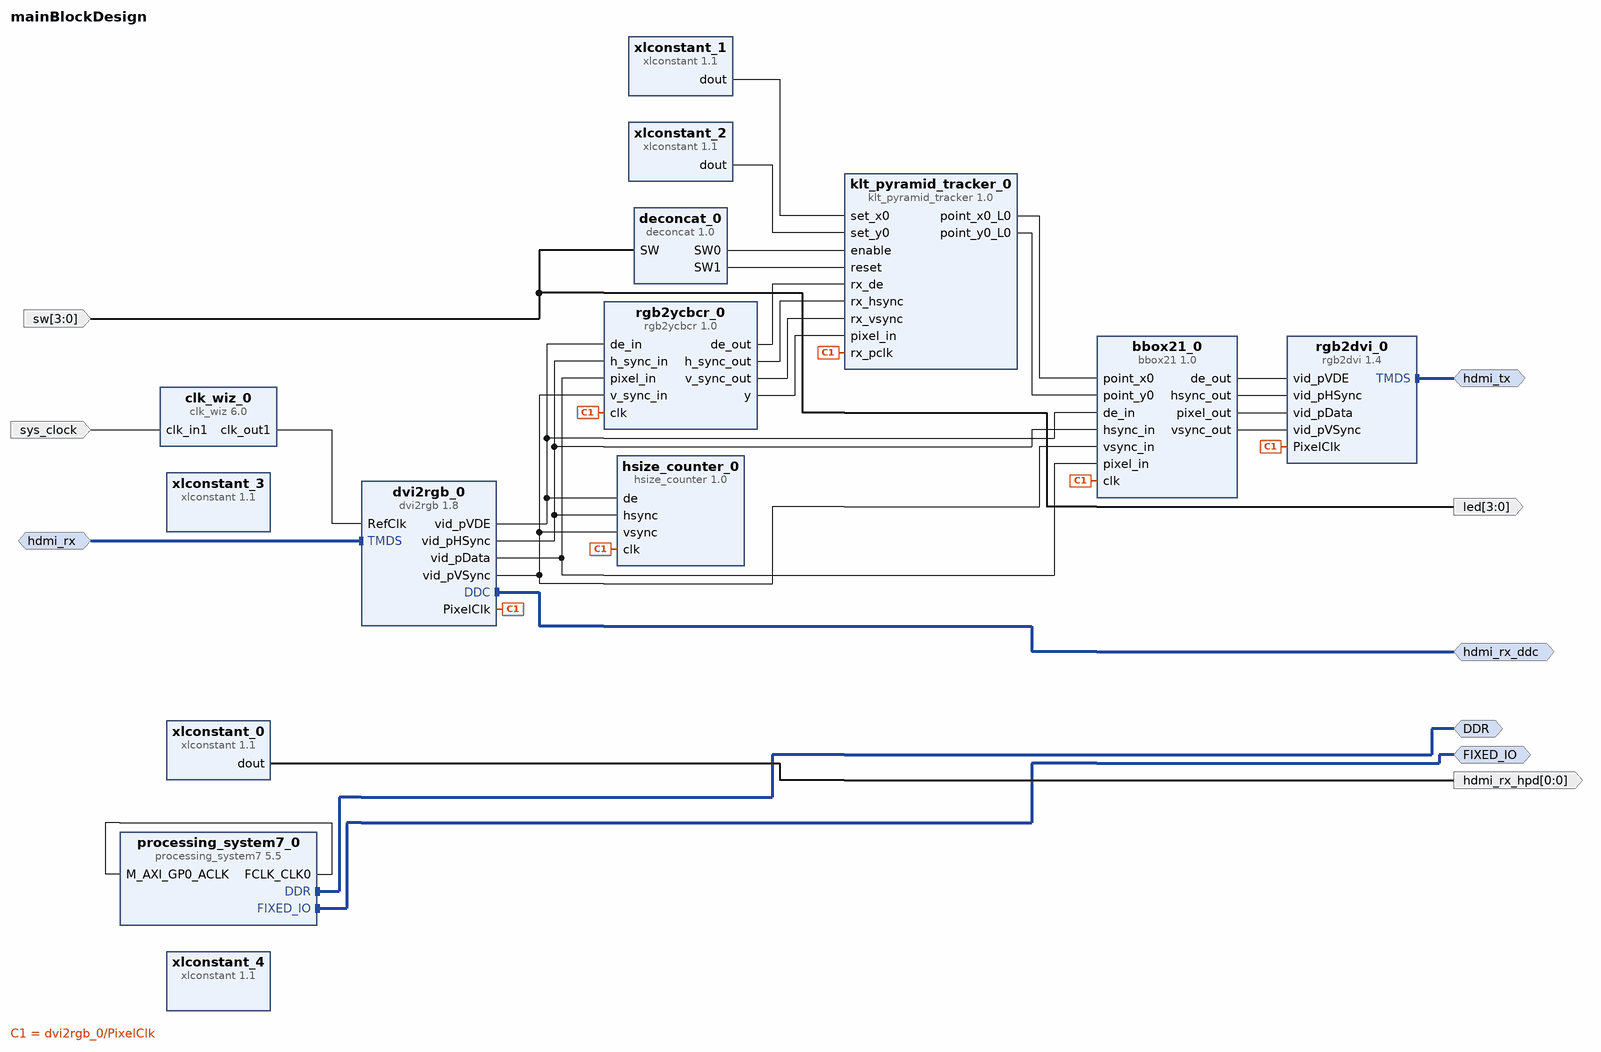
[diagram p0: block diagram of the top level]
# Vivado block design mainBlockDesign, xc7z020clg400-1, Vivado 2018.2
create_bd_design mainBlockDesign

create_bd_intf_port -mode Slave -vlnv digilentinc.com:interface:tmds_rtl:1.0 hdmi_rx
create_bd_intf_port -mode Master -vlnv digilentinc.com:interface:tmds_rtl:1.0 hdmi_tx
create_bd_intf_port -mode Master -vlnv xilinx.com:interface:iic_rtl:1.0 hdmi_rx_ddc
create_bd_intf_port -mode Master -vlnv xilinx.com:interface:ddrx_rtl:1.0 DDR
create_bd_intf_port -mode Master -vlnv xilinx.com:display_processing_system7:fixedio_rtl:1.0 FIXED_IO
create_bd_port -dir O -from 0 -to 0 hdmi_rx_hpd
create_bd_port -dir I -type clk sys_clock
set_property -dict {CONFIG.FREQ_HZ 125000000 CONFIG.PHASE 0.000} [get_bd_ports sys_clock]
create_bd_port -dir I -from 3 -to 0 sw
create_bd_port -dir O -from 3 -to 0 led

create_bd_cell -type ip -vlnv digilentinc.com:ip:dvi2rgb:1.8 dvi2rgb_0
set_property -dict [list \
  CONFIG.kEmulateDDC true \
  CONFIG.kEnableSerialClkOutput false \
  CONFIG.kRstActiveHigh true \
  CONFIG.kClkRange 1 \
  CONFIG.kEdidFileName dgl_1080p_cea.data \
] [get_bd_cells dvi2rgb_0]
create_bd_cell -type ip -vlnv xilinx.com:ip:clk_wiz:6.0 clk_wiz_0
set_property -dict [list \
  CONFIG.PRIMITIVE PLL \
  CONFIG.PRIM_IN_FREQ 125.000 \
  CONFIG.CLKIN1_JITTER_PS 80.0 \
  CONFIG.CLKOUT1_REQUESTED_OUT_FREQ 200 \
  CONFIG.CLKOUT1_DRIVES BUFG \
  CONFIG.CLKOUT2_DRIVES BUFG \
  CONFIG.CLKOUT3_DRIVES BUFG \
  CONFIG.CLKOUT4_DRIVES BUFG \
  CONFIG.CLKOUT5_DRIVES BUFG \
  CONFIG.CLKOUT6_DRIVES BUFG \
  CONFIG.CLKOUT7_DRIVES BUFG \
  CONFIG.FEEDBACK_SOURCE FDBK_AUTO \
  CONFIG.USE_LOCKED false \
  CONFIG.USE_RESET false \
  CONFIG.MMCM_DIVCLK_DIVIDE 1 \
  CONFIG.MMCM_CLKFBOUT_MULT_F 8 \
  CONFIG.MMCM_CLKIN1_PERIOD 8.000 \
  CONFIG.MMCM_CLKIN2_PERIOD 10.0 \
  CONFIG.MMCM_COMPENSATION ZHOLD \
  CONFIG.MMCM_CLKOUT0_DIVIDE_F 5 \
  CONFIG.USE_BOARD_FLOW true \
  CONFIG.CLK_IN1_BOARD_INTERFACE sys_clock \
  CONFIG.CLKOUT1_JITTER 109.241 \
  CONFIG.CLKOUT1_PHASE_ERROR 96.948 \
] [get_bd_cells clk_wiz_0]
create_bd_cell -type ip -vlnv digilentinc.com:ip:rgb2dvi:1.4 rgb2dvi_0
set_property -dict {CONFIG.kRstActiveHigh true CONFIG.kGenerateSerialClk true CONFIG.kClkRange 1} [get_bd_cells rgb2dvi_0]
create_bd_cell -type ip -vlnv xilinx.com:ip:xlconstant:1.1 xlconstant_0
create_bd_cell -type ip -vlnv user.org:user:rgb2ycbcr:1.0 rgb2ycbcr_0
create_bd_cell -type ip -vlnv nsn-intra.net:user:bbox21:1.0 bbox21_0
create_bd_cell -type ip -vlnv nsn-intra.net:user:klt_pyramid_tracker:1.0 klt_pyramid_tracker_0
create_bd_cell -type ip -vlnv xilinx.com:ip:xlconstant:1.1 xlconstant_1
set_property -dict {CONFIG.CONST_WIDTH 12 CONFIG.CONST_VAL 860} [get_bd_cells xlconstant_1]
create_bd_cell -type ip -vlnv xilinx.com:ip:xlconstant:1.1 xlconstant_2
set_property -dict {CONFIG.CONST_WIDTH 11 CONFIG.CONST_VAL 540} [get_bd_cells xlconstant_2]
create_bd_cell -type ip -vlnv xilinx.com:ip:xlconstant:1.1 xlconstant_3
set_property -dict {CONFIG.CONST_VAL 0} [get_bd_cells xlconstant_3]
create_bd_cell -type ip -vlnv xilinx.com:ip:xlconstant:1.1 xlconstant_4
create_bd_cell -type ip -vlnv nsn-intra.net:user:deconcat:1.0 deconcat_0
create_bd_cell -type ip -vlnv xilinx.com:ip:processing_system7:5.5 processing_system7_0
set_property -dict [list \
  CONFIG.PCW_UIPARAM_DDR_FREQ_MHZ 533.333333 \
  CONFIG.PCW_APU_PERIPHERAL_FREQMHZ 667 \
  CONFIG.PCW_SDIO_PERIPHERAL_FREQMHZ 50 \
  CONFIG.PCW_UART_PERIPHERAL_FREQMHZ 100 \
  CONFIG.PCW_PRESET_BANK1_VOLTAGE {LVCMOS 1.8V} \
  CONFIG.PCW_UIPARAM_DDR_MEMORY_TYPE {DDR 3 (Low Voltage)} \
  CONFIG.PCW_UIPARAM_DDR_PARTNO {MT41K256M16 RE-125} \
  CONFIG.PCW_QSPI_PERIPHERAL_ENABLE 0 \
  CONFIG.PCW_ENET0_PERIPHERAL_ENABLE 1 \
  CONFIG.PCW_ENET0_ENET0_IO {MIO 16 .. 27} \
  CONFIG.PCW_ENET0_GRP_MDIO_ENABLE 1 \
  CONFIG.PCW_ENET0_GRP_MDIO_IO {MIO 52 .. 53} \
  CONFIG.PCW_SD0_PERIPHERAL_ENABLE 0 \
  CONFIG.PCW_UART1_PERIPHERAL_ENABLE 1 \
  CONFIG.PCW_UART1_UART1_IO {MIO 48 .. 49} \
  CONFIG.PCW_USB0_PERIPHERAL_ENABLE 0 \
  CONFIG.PCW_GPIO_MIO_GPIO_ENABLE 0 \
  CONFIG.preset Default \
] [get_bd_cells processing_system7_0]
# 186 more settings of processing_system7_0 are not shown: defaults, MIO pin electricals, DDR timing, and values the tool derives
create_bd_cell -type ip -vlnv nsn-intra.net:user:hsize_counter:1.0 hsize_counter_0

# ---- connections ----

connect_bd_intf_net [get_bd_intf_ports hdmi_rx] [get_bd_intf_pins dvi2rgb_0/TMDS]
connect_bd_intf_net [get_bd_intf_ports hdmi_tx] [get_bd_intf_pins rgb2dvi_0/TMDS]
connect_bd_intf_net [get_bd_intf_ports hdmi_rx_ddc] [get_bd_intf_pins dvi2rgb_0/DDC]
connect_bd_intf_net [get_bd_intf_ports DDR] [get_bd_intf_pins processing_system7_0/DDR]
connect_bd_intf_net [get_bd_intf_ports FIXED_IO] [get_bd_intf_pins processing_system7_0/FIXED_IO]
connect_bd_net [get_bd_pins clk_wiz_0/clk_out1] [get_bd_pins dvi2rgb_0/RefClk]
connect_bd_net [get_bd_pins dvi2rgb_0/PixelClk] \
  [get_bd_pins rgb2dvi_0/PixelClk] [get_bd_pins rgb2ycbcr_0/clk] [get_bd_pins bbox21_0/clk] \
  [get_bd_pins klt_pyramid_tracker_0/rx_pclk] [get_bd_pins hsize_counter_0/clk]
connect_bd_net [get_bd_pins xlconstant_0/dout] [get_bd_ports hdmi_rx_hpd]
connect_bd_net [get_bd_ports sys_clock] [get_bd_pins clk_wiz_0/clk_in1]
connect_bd_net [get_bd_pins dvi2rgb_0/vid_pVDE] [get_bd_pins rgb2ycbcr_0/de_in] [get_bd_pins bbox21_0/de_in] [get_bd_pins hsize_counter_0/de]
connect_bd_net [get_bd_pins dvi2rgb_0/vid_pHSync] \
  [get_bd_pins rgb2ycbcr_0/h_sync_in] [get_bd_pins bbox21_0/hsync_in] [get_bd_pins hsize_counter_0/hsync]
connect_bd_net [get_bd_pins dvi2rgb_0/vid_pVSync] \
  [get_bd_pins rgb2ycbcr_0/v_sync_in] [get_bd_pins bbox21_0/vsync_in] [get_bd_pins hsize_counter_0/vsync]
connect_bd_net [get_bd_pins dvi2rgb_0/vid_pData] [get_bd_pins rgb2ycbcr_0/pixel_in] [get_bd_pins bbox21_0/pixel_in]
connect_bd_net [get_bd_pins rgb2ycbcr_0/de_out] [get_bd_pins klt_pyramid_tracker_0/rx_de]
connect_bd_net [get_bd_pins rgb2ycbcr_0/h_sync_out] [get_bd_pins klt_pyramid_tracker_0/rx_hsync]
connect_bd_net [get_bd_pins rgb2ycbcr_0/v_sync_out] [get_bd_pins klt_pyramid_tracker_0/rx_vsync]
connect_bd_net [get_bd_pins rgb2ycbcr_0/y] [get_bd_pins klt_pyramid_tracker_0/pixel_in]
connect_bd_net [get_bd_pins xlconstant_1/dout] [get_bd_pins klt_pyramid_tracker_0/set_x0]
connect_bd_net [get_bd_pins xlconstant_2/dout] [get_bd_pins klt_pyramid_tracker_0/set_y0]
connect_bd_net [get_bd_pins klt_pyramid_tracker_0/point_x0_L0] [get_bd_pins bbox21_0/point_x0]
connect_bd_net [get_bd_pins klt_pyramid_tracker_0/point_y0_L0] [get_bd_pins bbox21_0/point_y0]
connect_bd_net [get_bd_pins bbox21_0/de_out] [get_bd_pins rgb2dvi_0/vid_pVDE]
connect_bd_net [get_bd_pins bbox21_0/hsync_out] [get_bd_pins rgb2dvi_0/vid_pHSync]
connect_bd_net [get_bd_pins bbox21_0/pixel_out] [get_bd_pins rgb2dvi_0/vid_pData]
connect_bd_net [get_bd_pins bbox21_0/vsync_out] [get_bd_pins rgb2dvi_0/vid_pVSync]
connect_bd_net [get_bd_ports sw] [get_bd_pins deconcat_0/SW] [get_bd_ports led]
connect_bd_net [get_bd_pins deconcat_0/SW0] [get_bd_pins klt_pyramid_tracker_0/enable]
connect_bd_net [get_bd_pins deconcat_0/SW1] [get_bd_pins klt_pyramid_tracker_0/reset]
connect_bd_net [get_bd_pins processing_system7_0/FCLK_CLK0] [get_bd_pins processing_system7_0/M_AXI_GP0_ACLK]

validate_bd_design
save_bd_design
